# EAGLE schematic TestBoardTarget (EAGLE 7.1.0)
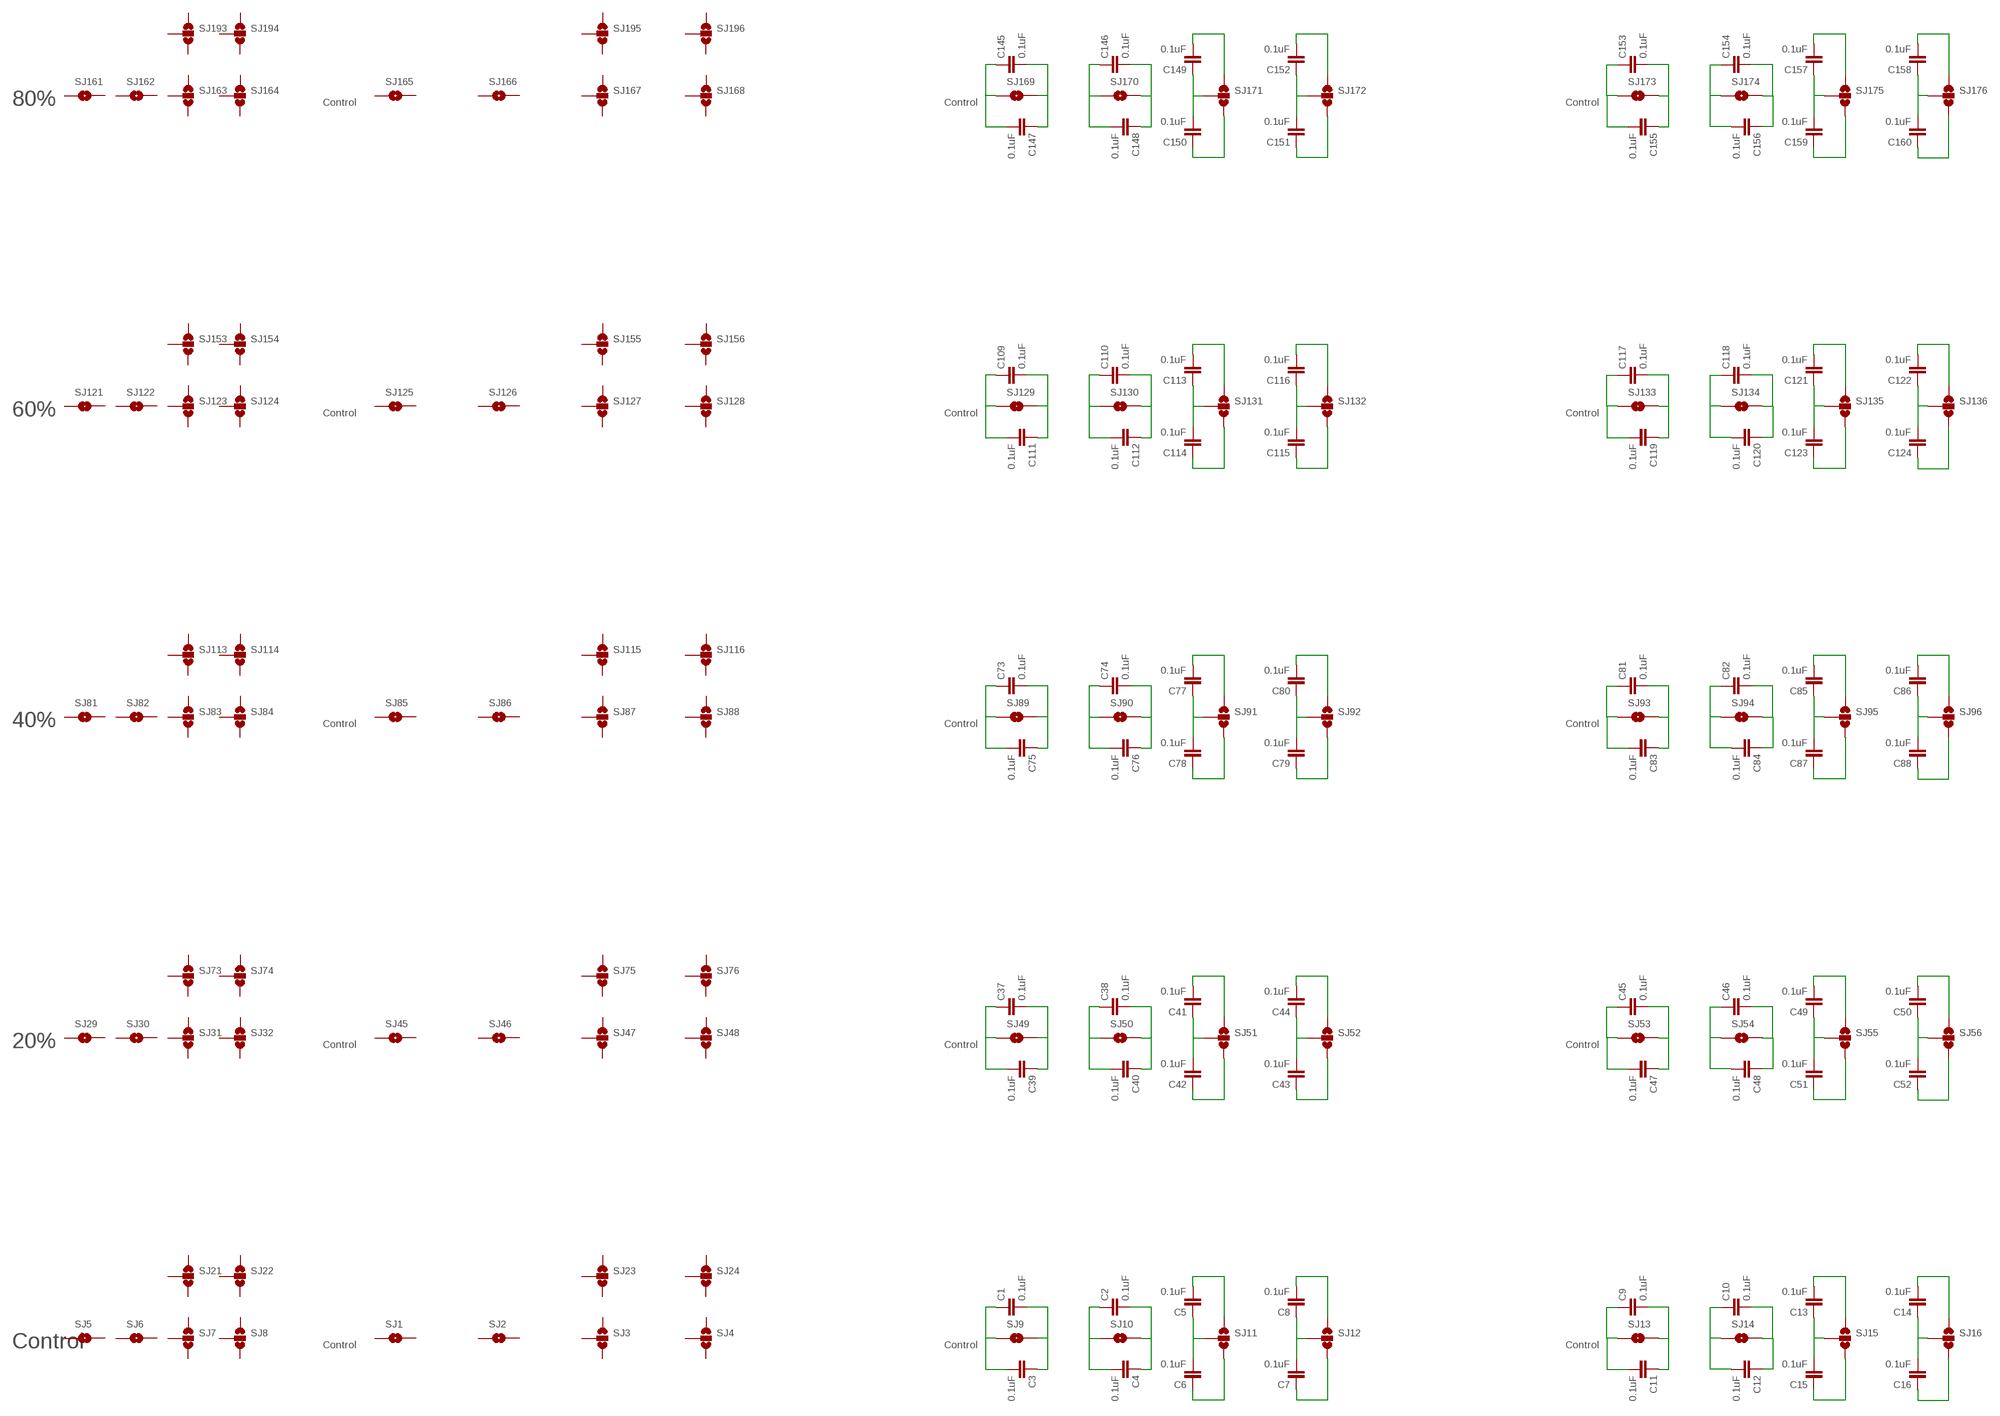
[diagram p0: schematic, sheet 1, part 1 of 3]
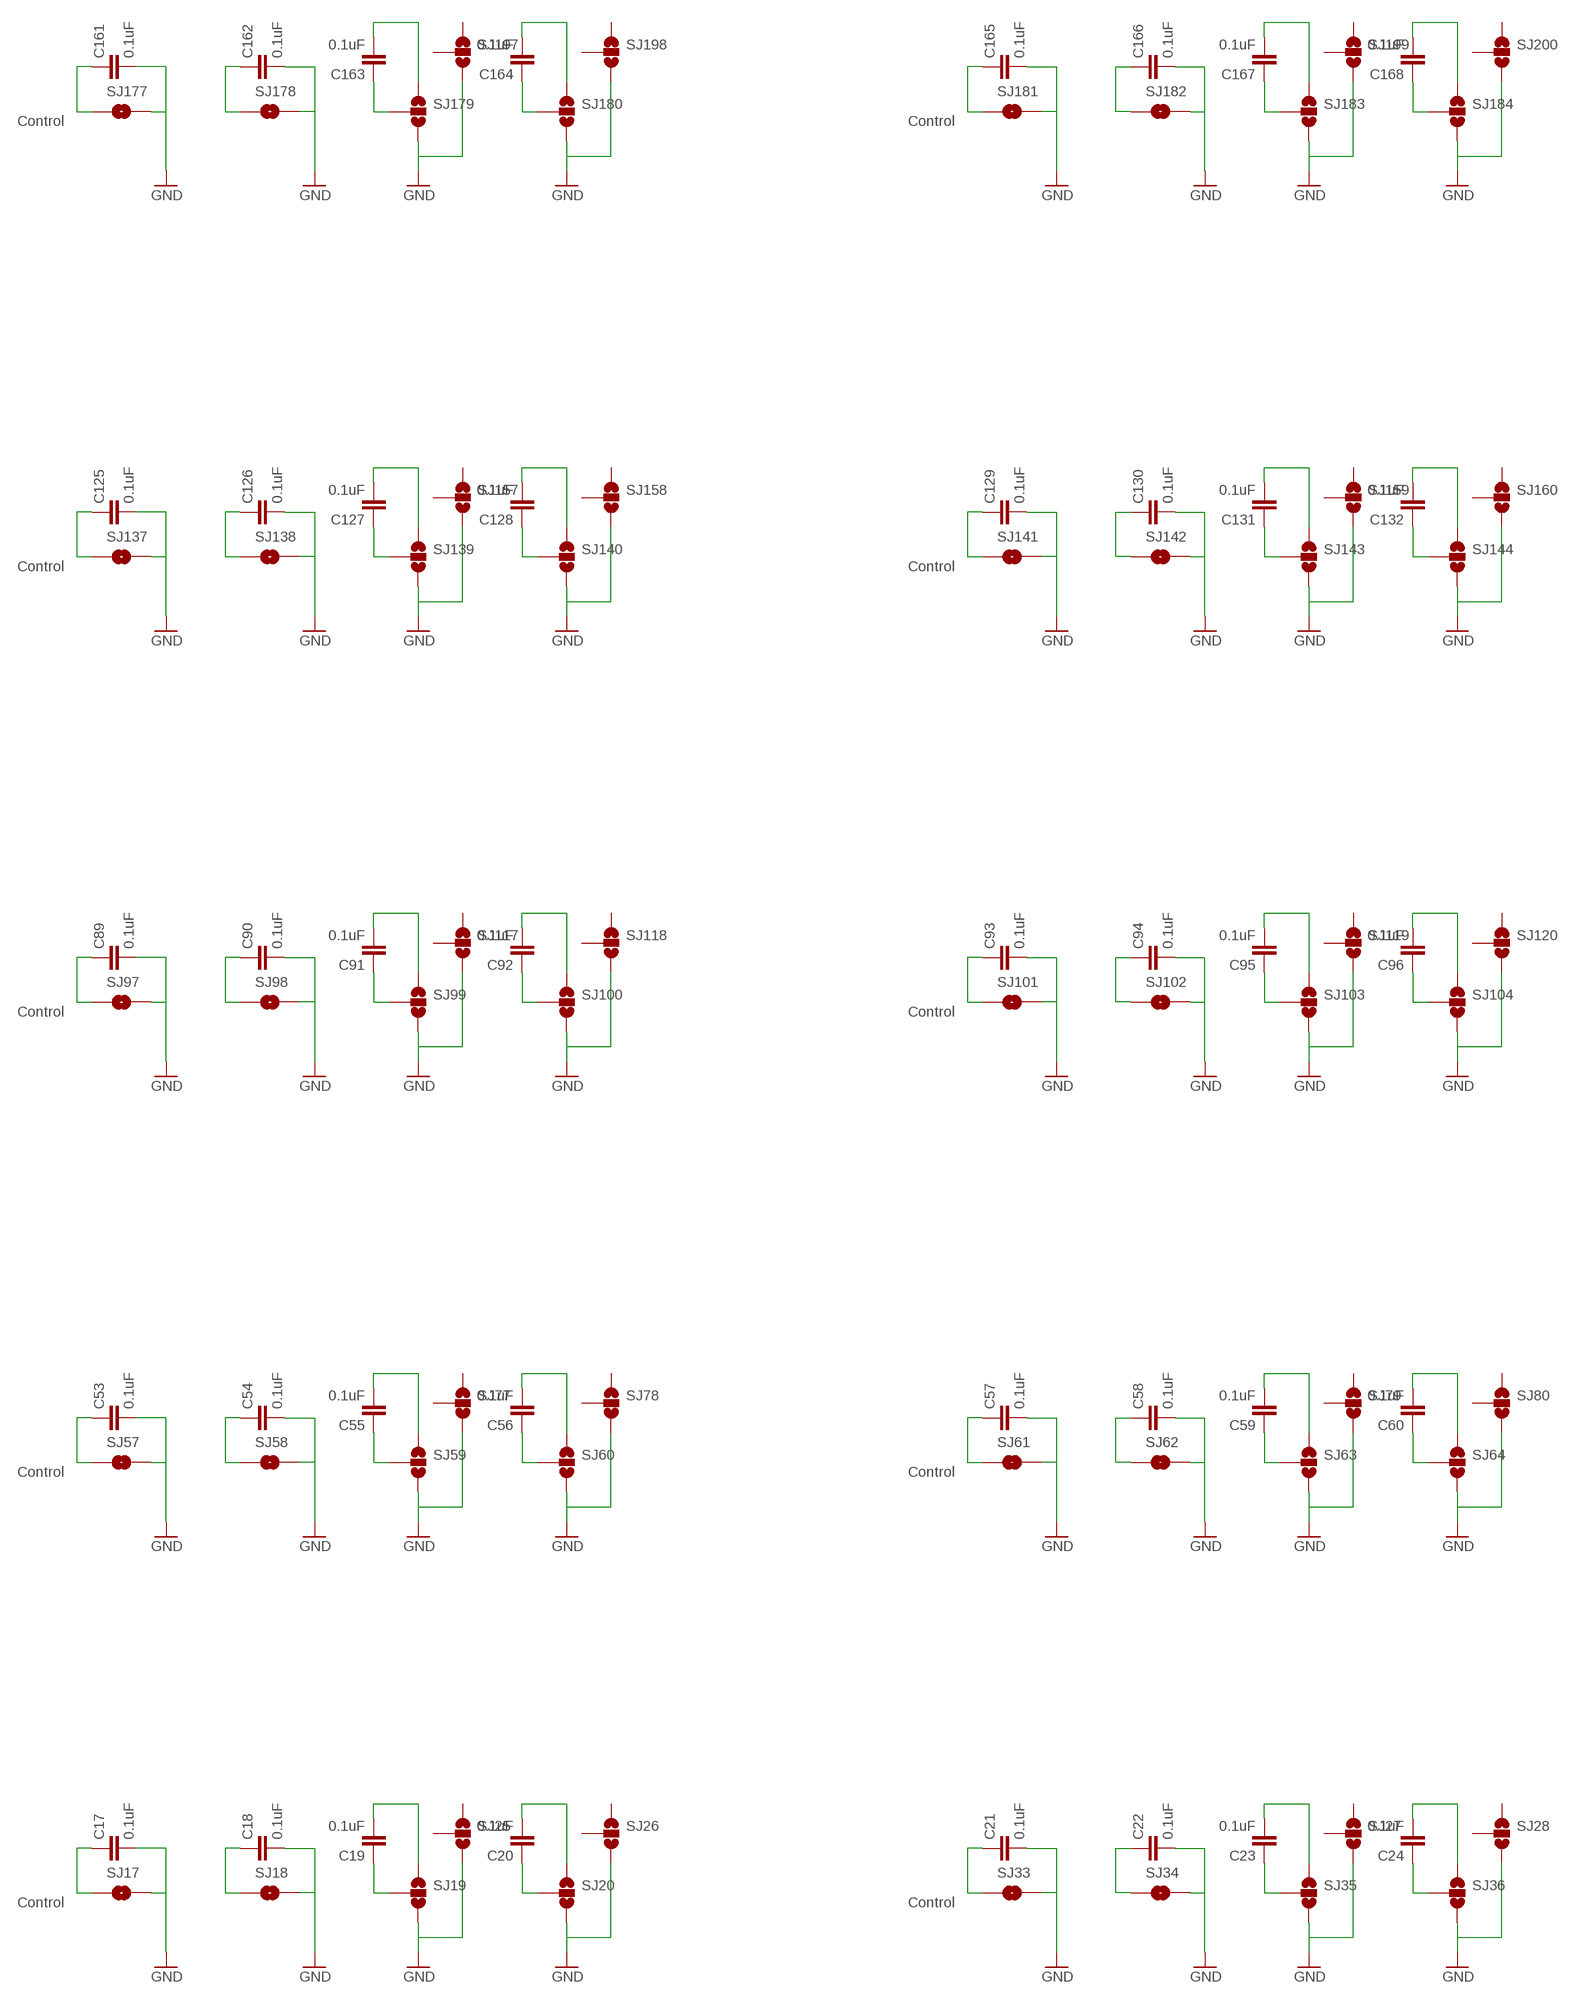
[diagram p1: schematic, sheet 1, part 2 of 3]
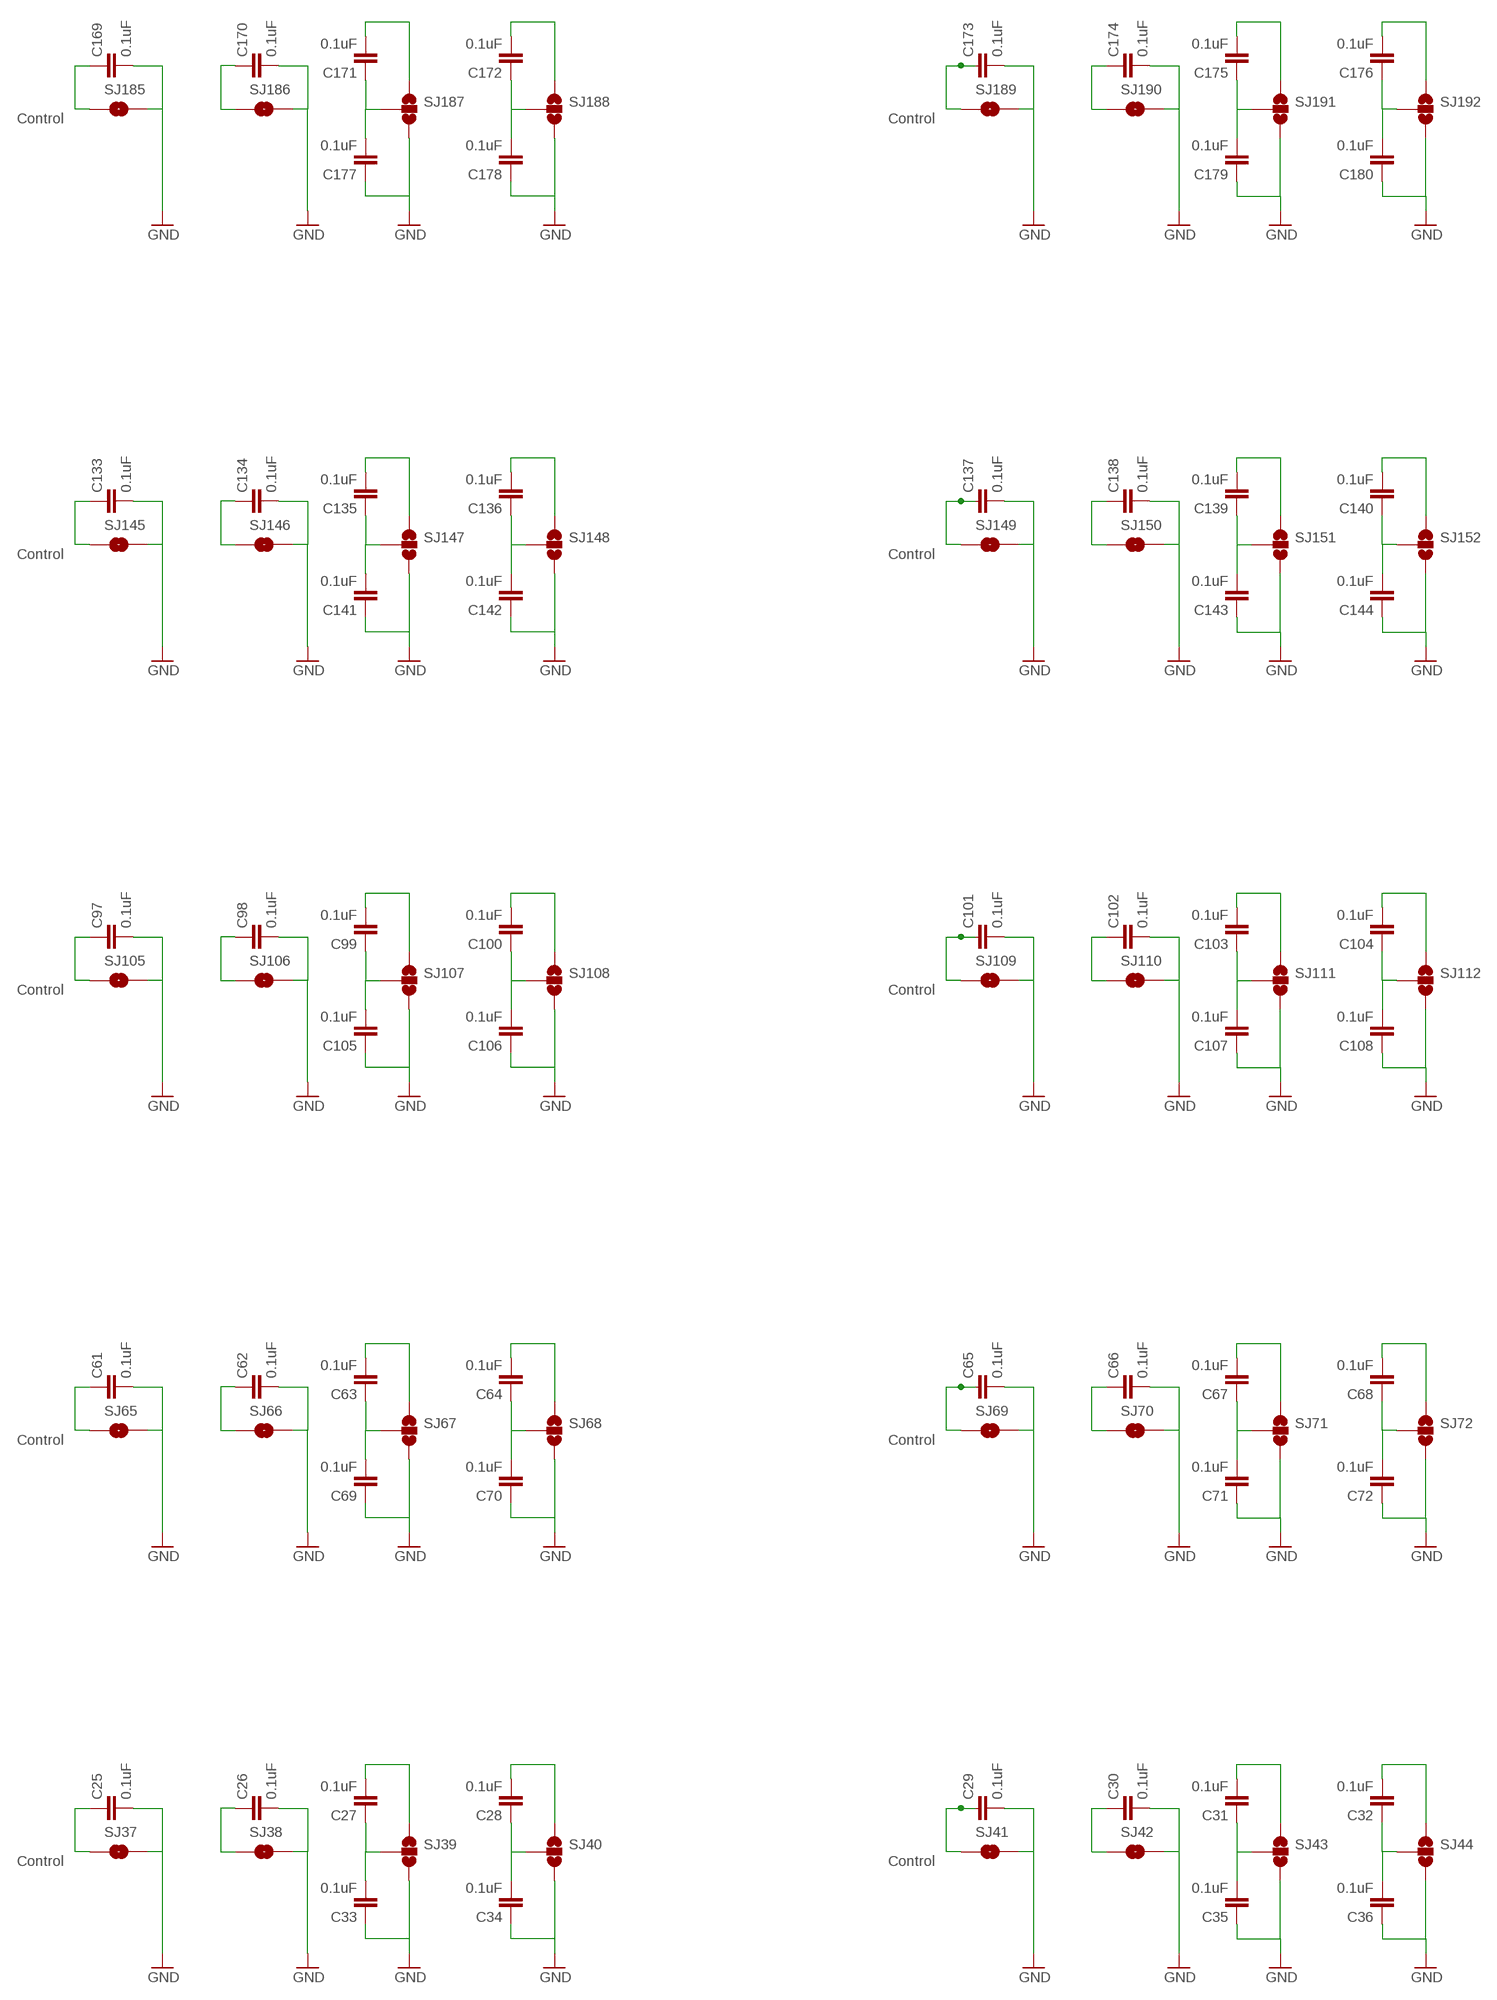
[diagram p2: schematic, sheet 1, part 3 of 3]

## Parts
C1  0.1uF  0.1UF-25V-5%(0603)  [0603-CAP]
C2  0.1uF  0.1UF-25V-5%(0603)  [0603-CAP]
C3  0.1uF  0.1UF-25V-5%(0603)  [0603-CAP]
C4  0.1uF  0.1UF-25V-5%(0603)  [0603-CAP]
C5  0.1uF  0.1UF-25V-5%(0603)  [0603-CAP]
C6  0.1uF  0.1UF-25V-5%(0603)  [0603-CAP]
C7  0.1uF  0.1UF-25V-5%(0603)  [0603-CAP]
C8  0.1uF  0.1UF-25V-5%(0603)  [0603-CAP]
C9  0.1uF  0.1UF-25V-5%(0603)  [0603-CAP]
C10  0.1uF  0.1UF-25V-5%(0603)  [0603-CAP]
C11  0.1uF  0.1UF-25V-5%(0603)  [0603-CAP]
C12  0.1uF  0.1UF-25V-5%(0603)  [0603-CAP]
C13  0.1uF  0.1UF-25V-5%(0603)  [0603-CAP]
C14  0.1uF  0.1UF-25V-5%(0603)  [0603-CAP]
C15  0.1uF  0.1UF-25V-5%(0603)  [0603-CAP]
C16  0.1uF  0.1UF-25V-5%(0603)  [0603-CAP]
C17  0.1uF  0.1UF-25V-5%(0603)  [0603-CAP]
C18  0.1uF  0.1UF-25V-5%(0603)  [0603-CAP]
C19  0.1uF  0.1UF-25V-5%(0603)  [0603-CAP]
C20  0.1uF  0.1UF-25V-5%(0603)  [0603-CAP]
C21  0.1uF  0.1UF-25V-5%(0603)  [0603-CAP]
C22  0.1uF  0.1UF-25V-5%(0603)  [0603-CAP]
C23  0.1uF  0.1UF-25V-5%(0603)  [0603-CAP]
C24  0.1uF  0.1UF-25V-5%(0603)  [0603-CAP]
C25  0.1uF  0.1UF-25V-5%(0603)  [0603-CAP]
C26  0.1uF  0.1UF-25V-5%(0603)  [0603-CAP]
C27  0.1uF  0.1UF-25V-5%(0603)  [0603-CAP]
C28  0.1uF  0.1UF-25V-5%(0603)  [0603-CAP]
C29  0.1uF  0.1UF-25V-5%(0603)  [0603-CAP]
C30  0.1uF  0.1UF-25V-5%(0603)  [0603-CAP]
C31  0.1uF  0.1UF-25V-5%(0603)  [0603-CAP]
C32  0.1uF  0.1UF-25V-5%(0603)  [0603-CAP]
C33  0.1uF  0.1UF-25V-5%(0603)  [0603-CAP]
C34  0.1uF  0.1UF-25V-5%(0603)  [0603-CAP]
C35  0.1uF  0.1UF-25V-5%(0603)  [0603-CAP]
C36  0.1uF  0.1UF-25V-5%(0603)  [0603-CAP]
C37  0.1uF  0.1UF-25V-5%(0603)  [0603-CAP]
C38  0.1uF  0.1UF-25V-5%(0603)  [0603-CAP]
C39  0.1uF  0.1UF-25V-5%(0603)  [0603-CAP]
C40  0.1uF  0.1UF-25V-5%(0603)  [0603-CAP]
C41  0.1uF  0.1UF-25V-5%(0603)  [0603-CAP]
C42  0.1uF  0.1UF-25V-5%(0603)  [0603-CAP]
C43  0.1uF  0.1UF-25V-5%(0603)  [0603-CAP]
C44  0.1uF  0.1UF-25V-5%(0603)  [0603-CAP]
C45  0.1uF  0.1UF-25V-5%(0603)  [0603-CAP]
C46  0.1uF  0.1UF-25V-5%(0603)  [0603-CAP]
C47  0.1uF  0.1UF-25V-5%(0603)  [0603-CAP]
C48  0.1uF  0.1UF-25V-5%(0603)  [0603-CAP]
C49  0.1uF  0.1UF-25V-5%(0603)  [0603-CAP]
C50  0.1uF  0.1UF-25V-5%(0603)  [0603-CAP]
C51  0.1uF  0.1UF-25V-5%(0603)  [0603-CAP]
C52  0.1uF  0.1UF-25V-5%(0603)  [0603-CAP]
C53  0.1uF  0.1UF-25V-5%(0603)  [0603-CAP]
C54  0.1uF  0.1UF-25V-5%(0603)  [0603-CAP]
C55  0.1uF  0.1UF-25V-5%(0603)  [0603-CAP]
C56  0.1uF  0.1UF-25V-5%(0603)  [0603-CAP]
C57  0.1uF  0.1UF-25V-5%(0603)  [0603-CAP]
C58  0.1uF  0.1UF-25V-5%(0603)  [0603-CAP]
C59  0.1uF  0.1UF-25V-5%(0603)  [0603-CAP]
C60  0.1uF  0.1UF-25V-5%(0603)  [0603-CAP]
C61  0.1uF  0.1UF-25V-5%(0603)  [0603-CAP]
C62  0.1uF  0.1UF-25V-5%(0603)  [0603-CAP]
C63  0.1uF  0.1UF-25V-5%(0603)  [0603-CAP]
C64  0.1uF  0.1UF-25V-5%(0603)  [0603-CAP]
C65  0.1uF  0.1UF-25V-5%(0603)  [0603-CAP]
C66  0.1uF  0.1UF-25V-5%(0603)  [0603-CAP]
C67  0.1uF  0.1UF-25V-5%(0603)  [0603-CAP]
C68  0.1uF  0.1UF-25V-5%(0603)  [0603-CAP]
C69  0.1uF  0.1UF-25V-5%(0603)  [0603-CAP]
C70  0.1uF  0.1UF-25V-5%(0603)  [0603-CAP]
C71  0.1uF  0.1UF-25V-5%(0603)  [0603-CAP]
C72  0.1uF  0.1UF-25V-5%(0603)  [0603-CAP]
C73  0.1uF  0.1UF-25V-5%(0603)  [0603-CAP]
C74  0.1uF  0.1UF-25V-5%(0603)  [0603-CAP]
C75  0.1uF  0.1UF-25V-5%(0603)  [0603-CAP]
C76  0.1uF  0.1UF-25V-5%(0603)  [0603-CAP]
C77  0.1uF  0.1UF-25V-5%(0603)  [0603-CAP]
C78  0.1uF  0.1UF-25V-5%(0603)  [0603-CAP]
C79  0.1uF  0.1UF-25V-5%(0603)  [0603-CAP]
C80  0.1uF  0.1UF-25V-5%(0603)  [0603-CAP]
C81  0.1uF  0.1UF-25V-5%(0603)  [0603-CAP]
C82  0.1uF  0.1UF-25V-5%(0603)  [0603-CAP]
C83  0.1uF  0.1UF-25V-5%(0603)  [0603-CAP]
C84  0.1uF  0.1UF-25V-5%(0603)  [0603-CAP]
C85  0.1uF  0.1UF-25V-5%(0603)  [0603-CAP]
C86  0.1uF  0.1UF-25V-5%(0603)  [0603-CAP]
C87  0.1uF  0.1UF-25V-5%(0603)  [0603-CAP]
C88  0.1uF  0.1UF-25V-5%(0603)  [0603-CAP]
C89  0.1uF  0.1UF-25V-5%(0603)  [0603-CAP]
C90  0.1uF  0.1UF-25V-5%(0603)  [0603-CAP]
C91  0.1uF  0.1UF-25V-5%(0603)  [0603-CAP]
C92  0.1uF  0.1UF-25V-5%(0603)  [0603-CAP]
C93  0.1uF  0.1UF-25V-5%(0603)  [0603-CAP]
C94  0.1uF  0.1UF-25V-5%(0603)  [0603-CAP]
C95  0.1uF  0.1UF-25V-5%(0603)  [0603-CAP]
C96  0.1uF  0.1UF-25V-5%(0603)  [0603-CAP]
C97  0.1uF  0.1UF-25V-5%(0603)  [0603-CAP]
C98  0.1uF  0.1UF-25V-5%(0603)  [0603-CAP]
C99  0.1uF  0.1UF-25V-5%(0603)  [0603-CAP]
C100  0.1uF  0.1UF-25V-5%(0603)  [0603-CAP]
C101  0.1uF  0.1UF-25V-5%(0603)  [0603-CAP]
C102  0.1uF  0.1UF-25V-5%(0603)  [0603-CAP]
C103  0.1uF  0.1UF-25V-5%(0603)  [0603-CAP]
C104  0.1uF  0.1UF-25V-5%(0603)  [0603-CAP]
C105  0.1uF  0.1UF-25V-5%(0603)  [0603-CAP]
C106  0.1uF  0.1UF-25V-5%(0603)  [0603-CAP]
C107  0.1uF  0.1UF-25V-5%(0603)  [0603-CAP]
C108  0.1uF  0.1UF-25V-5%(0603)  [0603-CAP]
C109  0.1uF  0.1UF-25V-5%(0603)  [0603-CAP]
C110  0.1uF  0.1UF-25V-5%(0603)  [0603-CAP]
C111  0.1uF  0.1UF-25V-5%(0603)  [0603-CAP]
C112  0.1uF  0.1UF-25V-5%(0603)  [0603-CAP]
C113  0.1uF  0.1UF-25V-5%(0603)  [0603-CAP]
C114  0.1uF  0.1UF-25V-5%(0603)  [0603-CAP]
C115  0.1uF  0.1UF-25V-5%(0603)  [0603-CAP]
C116  0.1uF  0.1UF-25V-5%(0603)  [0603-CAP]
C117  0.1uF  0.1UF-25V-5%(0603)  [0603-CAP]
C118  0.1uF  0.1UF-25V-5%(0603)  [0603-CAP]
C119  0.1uF  0.1UF-25V-5%(0603)  [0603-CAP]
C120  0.1uF  0.1UF-25V-5%(0603)  [0603-CAP]
C121  0.1uF  0.1UF-25V-5%(0603)  [0603-CAP]
C122  0.1uF  0.1UF-25V-5%(0603)  [0603-CAP]
C123  0.1uF  0.1UF-25V-5%(0603)  [0603-CAP]
C124  0.1uF  0.1UF-25V-5%(0603)  [0603-CAP]
C125  0.1uF  0.1UF-25V-5%(0603)  [0603-CAP]
C126  0.1uF  0.1UF-25V-5%(0603)  [0603-CAP]
C127  0.1uF  0.1UF-25V-5%(0603)  [0603-CAP]
C128  0.1uF  0.1UF-25V-5%(0603)  [0603-CAP]
C129  0.1uF  0.1UF-25V-5%(0603)  [0603-CAP]
C130  0.1uF  0.1UF-25V-5%(0603)  [0603-CAP]
C131  0.1uF  0.1UF-25V-5%(0603)  [0603-CAP]
C132  0.1uF  0.1UF-25V-5%(0603)  [0603-CAP]
C133  0.1uF  0.1UF-25V-5%(0603)  [0603-CAP]
C134  0.1uF  0.1UF-25V-5%(0603)  [0603-CAP]
C135  0.1uF  0.1UF-25V-5%(0603)  [0603-CAP]
C136  0.1uF  0.1UF-25V-5%(0603)  [0603-CAP]
C137  0.1uF  0.1UF-25V-5%(0603)  [0603-CAP]
C138  0.1uF  0.1UF-25V-5%(0603)  [0603-CAP]
C139  0.1uF  0.1UF-25V-5%(0603)  [0603-CAP]
C140  0.1uF  0.1UF-25V-5%(0603)  [0603-CAP]
C141  0.1uF  0.1UF-25V-5%(0603)  [0603-CAP]
C142  0.1uF  0.1UF-25V-5%(0603)  [0603-CAP]
C143  0.1uF  0.1UF-25V-5%(0603)  [0603-CAP]
C144  0.1uF  0.1UF-25V-5%(0603)  [0603-CAP]
C145  0.1uF  0.1UF-25V-5%(0603)  [0603-CAP]
C146  0.1uF  0.1UF-25V-5%(0603)  [0603-CAP]
C147  0.1uF  0.1UF-25V-5%(0603)  [0603-CAP]
C148  0.1uF  0.1UF-25V-5%(0603)  [0603-CAP]
C149  0.1uF  0.1UF-25V-5%(0603)  [0603-CAP]
C150  0.1uF  0.1UF-25V-5%(0603)  [0603-CAP]
C151  0.1uF  0.1UF-25V-5%(0603)  [0603-CAP]
C152  0.1uF  0.1UF-25V-5%(0603)  [0603-CAP]
C153  0.1uF  0.1UF-25V-5%(0603)  [0603-CAP]
C154  0.1uF  0.1UF-25V-5%(0603)  [0603-CAP]
C155  0.1uF  0.1UF-25V-5%(0603)  [0603-CAP]
C156  0.1uF  0.1UF-25V-5%(0603)  [0603-CAP]
C157  0.1uF  0.1UF-25V-5%(0603)  [0603-CAP]
C158  0.1uF  0.1UF-25V-5%(0603)  [0603-CAP]
C159  0.1uF  0.1UF-25V-5%(0603)  [0603-CAP]
C160  0.1uF  0.1UF-25V-5%(0603)  [0603-CAP]
C161  0.1uF  0.1UF-25V-5%(0603)  [0603-CAP]
C162  0.1uF  0.1UF-25V-5%(0603)  [0603-CAP]
C163  0.1uF  0.1UF-25V-5%(0603)  [0603-CAP]
C164  0.1uF  0.1UF-25V-5%(0603)  [0603-CAP]
C165  0.1uF  0.1UF-25V-5%(0603)  [0603-CAP]
C166  0.1uF  0.1UF-25V-5%(0603)  [0603-CAP]
C167  0.1uF  0.1UF-25V-5%(0603)  [0603-CAP]
C168  0.1uF  0.1UF-25V-5%(0603)  [0603-CAP]
C169  0.1uF  0.1UF-25V-5%(0603)  [0603-CAP]
C170  0.1uF  0.1UF-25V-5%(0603)  [0603-CAP]
C171  0.1uF  0.1UF-25V-5%(0603)  [0603-CAP]
C172  0.1uF  0.1UF-25V-5%(0603)  [0603-CAP]
C173  0.1uF  0.1UF-25V-5%(0603)  [0603-CAP]
C174  0.1uF  0.1UF-25V-5%(0603)  [0603-CAP]
C175  0.1uF  0.1UF-25V-5%(0603)  [0603-CAP]
C176  0.1uF  0.1UF-25V-5%(0603)  [0603-CAP]
C177  0.1uF  0.1UF-25V-5%(0603)  [0603-CAP]
C178  0.1uF  0.1UF-25V-5%(0603)  [0603-CAP]
C179  0.1uF  0.1UF-25V-5%(0603)  [0603-CAP]
C180  0.1uF  0.1UF-25V-5%(0603)  [0603-CAP]
SJ1  JUMPER-PAD-2-NO  [PAD-JUMPER-2-NO_NO_SILK]
SJ2  JUMPER-PAD-2-NO  [PAD-JUMPER-2-NO_NO_SILK]
SJ3  JUMPER-PAD-3-NOYES_SILK  [PAD-JUMPER-3-NO_YES_SILK]
SJ4  JUMPER-PAD-3-NOYES_SILK  [PAD-JUMPER-3-NO_YES_SILK]
SJ5  JUMPER-PAD-2-NO  [PAD-JUMPER-2-NO_NO_SILK]
SJ6  JUMPER-PAD-2-NO  [PAD-JUMPER-2-NO_NO_SILK]
SJ7  JUMPER-PAD-3-NOYES_SILK  [PAD-JUMPER-3-NO_YES_SILK]
SJ8  JUMPER-PAD-3-NOYES_SILK  [PAD-JUMPER-3-NO_YES_SILK]
SJ9  JUMPER-PAD-2-NO  [PAD-JUMPER-2-NO_NO_SILK]
SJ10  JUMPER-PAD-2-NO  [PAD-JUMPER-2-NO_NO_SILK]
SJ11  JUMPER-PAD-3-NOYES_SILK  [PAD-JUMPER-3-NO_YES_SILK]
SJ12  JUMPER-PAD-3-NOYES_SILK  [PAD-JUMPER-3-NO_YES_SILK]
SJ13  JUMPER-PAD-2-NO  [PAD-JUMPER-2-NO_NO_SILK]
SJ14  JUMPER-PAD-2-NO  [PAD-JUMPER-2-NO_NO_SILK]
SJ15  JUMPER-PAD-3-NOYES_SILK  [PAD-JUMPER-3-NO_YES_SILK]
SJ16  JUMPER-PAD-3-NOYES_SILK  [PAD-JUMPER-3-NO_YES_SILK]
SJ17  JUMPER-PAD-2-NO  [PAD-JUMPER-2-NO_NO_SILK]
SJ18  JUMPER-PAD-2-NO  [PAD-JUMPER-2-NO_NO_SILK]
SJ19  JUMPER-PAD-3-NOYES_SILK  [PAD-JUMPER-3-NO_YES_SILK]
SJ20  JUMPER-PAD-3-NOYES_SILK  [PAD-JUMPER-3-NO_YES_SILK]
SJ21  JUMPER-PAD-3-NOYES_SILK  [PAD-JUMPER-3-NO_YES_SILK]
SJ22  JUMPER-PAD-3-NOYES_SILK  [PAD-JUMPER-3-NO_YES_SILK]
SJ23  JUMPER-PAD-3-NOYES_SILK  [PAD-JUMPER-3-NO_YES_SILK]
SJ24  JUMPER-PAD-3-NOYES_SILK  [PAD-JUMPER-3-NO_YES_SILK]
SJ25  JUMPER-PAD-3-NO3_0  [PAD-JUMPER-3-NO_YES_SILK_ALL]
SJ26  JUMPER-PAD-3-NO3_0  [PAD-JUMPER-3-NO_YES_SILK_ALL]
SJ27  JUMPER-PAD-3-NO3_0  [PAD-JUMPER-3-NO_YES_SILK_ALL]
SJ28  JUMPER-PAD-3-NO3_0  [PAD-JUMPER-3-NO_YES_SILK_ALL]
SJ29  JUMPER-PAD-2-NO20  [PAD-JUMPER-2-NO_NO_SILK_20]
SJ30  JUMPER-PAD-2-NO20  [PAD-JUMPER-2-NO_NO_SILK_20]
SJ31  JUMPER-PAD-3-NO2_20  [PAD-JUMPER-3-NO_YES_SILK_20]
SJ32  JUMPER-PAD-3-NO2_20  [PAD-JUMPER-3-NO_YES_SILK_20]
SJ33  JUMPER-PAD-2-NO  [PAD-JUMPER-2-NO_NO_SILK]
SJ34  JUMPER-PAD-2-NO  [PAD-JUMPER-2-NO_NO_SILK]
SJ35  JUMPER-PAD-3-NOYES_SILK  [PAD-JUMPER-3-NO_YES_SILK]
SJ36  JUMPER-PAD-3-NOYES_SILK  [PAD-JUMPER-3-NO_YES_SILK]
SJ37  JUMPER-PAD-2-NO  [PAD-JUMPER-2-NO_NO_SILK]
SJ38  JUMPER-PAD-2-NO  [PAD-JUMPER-2-NO_NO_SILK]
SJ39  JUMPER-PAD-3-NOYES_SILK  [PAD-JUMPER-3-NO_YES_SILK]
SJ40  JUMPER-PAD-3-NOYES_SILK  [PAD-JUMPER-3-NO_YES_SILK]
SJ41  JUMPER-PAD-2-NO  [PAD-JUMPER-2-NO_NO_SILK]
SJ42  JUMPER-PAD-2-NO  [PAD-JUMPER-2-NO_NO_SILK]
SJ43  JUMPER-PAD-3-NOYES_SILK  [PAD-JUMPER-3-NO_YES_SILK]
SJ44  JUMPER-PAD-3-NOYES_SILK  [PAD-JUMPER-3-NO_YES_SILK]
SJ45  JUMPER-PAD-2-NO20  [PAD-JUMPER-2-NO_NO_SILK_20]
SJ46  JUMPER-PAD-2-NO20  [PAD-JUMPER-2-NO_NO_SILK_20]
SJ47  JUMPER-PAD-3-NO2_20  [PAD-JUMPER-3-NO_YES_SILK_20]
SJ48  JUMPER-PAD-3-NO2_20  [PAD-JUMPER-3-NO_YES_SILK_20]
SJ49  JUMPER-PAD-2-NO20  [PAD-JUMPER-2-NO_NO_SILK_20]
SJ50  JUMPER-PAD-2-NO20  [PAD-JUMPER-2-NO_NO_SILK_20]
SJ51  JUMPER-PAD-3-NO2_20  [PAD-JUMPER-3-NO_YES_SILK_20]
SJ52  JUMPER-PAD-3-NO2_20  [PAD-JUMPER-3-NO_YES_SILK_20]
SJ53  JUMPER-PAD-2-NO20  [PAD-JUMPER-2-NO_NO_SILK_20]
SJ54  JUMPER-PAD-2-NO20  [PAD-JUMPER-2-NO_NO_SILK_20]
SJ55  JUMPER-PAD-3-NO2_20  [PAD-JUMPER-3-NO_YES_SILK_20]
SJ56  JUMPER-PAD-3-NO2_20  [PAD-JUMPER-3-NO_YES_SILK_20]
SJ57  JUMPER-PAD-2-NO20  [PAD-JUMPER-2-NO_NO_SILK_20]
SJ58  JUMPER-PAD-2-NO20  [PAD-JUMPER-2-NO_NO_SILK_20]
SJ59  JUMPER-PAD-3-NO2_20  [PAD-JUMPER-3-NO_YES_SILK_20]
SJ60  JUMPER-PAD-3-NO2_20  [PAD-JUMPER-3-NO_YES_SILK_20]
SJ61  JUMPER-PAD-2-NO20  [PAD-JUMPER-2-NO_NO_SILK_20]
SJ62  JUMPER-PAD-2-NO20  [PAD-JUMPER-2-NO_NO_SILK_20]
SJ63  JUMPER-PAD-3-NO2_20  [PAD-JUMPER-3-NO_YES_SILK_20]
SJ64  JUMPER-PAD-3-NO2_20  [PAD-JUMPER-3-NO_YES_SILK_20]
SJ65  JUMPER-PAD-2-NO20  [PAD-JUMPER-2-NO_NO_SILK_20]
SJ66  JUMPER-PAD-2-NO20  [PAD-JUMPER-2-NO_NO_SILK_20]
SJ67  JUMPER-PAD-3-NO2_20  [PAD-JUMPER-3-NO_YES_SILK_20]
SJ68  JUMPER-PAD-3-NO2_20  [PAD-JUMPER-3-NO_YES_SILK_20]
SJ69  JUMPER-PAD-2-NO  [PAD-JUMPER-2-NO_NO_SILK]
SJ70  JUMPER-PAD-2-NO  [PAD-JUMPER-2-NO_NO_SILK]
SJ71  JUMPER-PAD-3-NO2_20  [PAD-JUMPER-3-NO_YES_SILK_20]
SJ72  JUMPER-PAD-3-NO2_20  [PAD-JUMPER-3-NO_YES_SILK_20]
SJ73  JUMPER-PAD-3-NOYES_SILK  [PAD-JUMPER-3-NO_YES_SILK]
SJ74  JUMPER-PAD-3-NOYES_SILK  [PAD-JUMPER-3-NO_YES_SILK]
SJ75  JUMPER-PAD-3-NOYES_SILK  [PAD-JUMPER-3-NO_YES_SILK]
SJ76  JUMPER-PAD-3-NOYES_SILK  [PAD-JUMPER-3-NO_YES_SILK]
SJ77  JUMPER-PAD-3-NO3_20  [PAD-JUMPER-3-NO_YES_SILK_ALL_20]
SJ78  JUMPER-PAD-3-NO3_20  [PAD-JUMPER-3-NO_YES_SILK_ALL_20]
SJ79  JUMPER-PAD-3-NO3_20  [PAD-JUMPER-3-NO_YES_SILK_ALL_20]
SJ80  JUMPER-PAD-3-NO3_20  [PAD-JUMPER-3-NO_YES_SILK_ALL_20]
SJ81  JUMPER-PAD-2-NO40  [PAD-JUMPER-2-NO_NO_SILK_40]
SJ82  JUMPER-PAD-2-NO40  [PAD-JUMPER-2-NO_NO_SILK_40]
SJ83  JUMPER-PAD-3-NO2_40  [PAD-JUMPER-3-NO_YES_SILK_40]
SJ84  JUMPER-PAD-3-NO2_40  [PAD-JUMPER-3-NO_YES_SILK_40]
SJ85  JUMPER-PAD-2-NO40  [PAD-JUMPER-2-NO_NO_SILK_40]
SJ86  JUMPER-PAD-2-NO40  [PAD-JUMPER-2-NO_NO_SILK_40]
SJ87  JUMPER-PAD-3-NO2_40  [PAD-JUMPER-3-NO_YES_SILK_40]
SJ88  JUMPER-PAD-3-NO2_40  [PAD-JUMPER-3-NO_YES_SILK_40]
SJ89  JUMPER-PAD-2-NO40  [PAD-JUMPER-2-NO_NO_SILK_40]
SJ90  JUMPER-PAD-2-NO40  [PAD-JUMPER-2-NO_NO_SILK_40]
SJ91  JUMPER-PAD-3-NO2_40  [PAD-JUMPER-3-NO_YES_SILK_40]
SJ92  JUMPER-PAD-3-NO2_40  [PAD-JUMPER-3-NO_YES_SILK_40]
SJ93  JUMPER-PAD-2-NO40  [PAD-JUMPER-2-NO_NO_SILK_40]
SJ94  JUMPER-PAD-2-NO40  [PAD-JUMPER-2-NO_NO_SILK_40]
SJ95  JUMPER-PAD-3-NO2_40  [PAD-JUMPER-3-NO_YES_SILK_40]
SJ96  JUMPER-PAD-3-NO2_40  [PAD-JUMPER-3-NO_YES_SILK_40]
SJ97  JUMPER-PAD-2-NO40  [PAD-JUMPER-2-NO_NO_SILK_40]
SJ98  JUMPER-PAD-2-NO40  [PAD-JUMPER-2-NO_NO_SILK_40]
SJ99  JUMPER-PAD-3-NO2_40  [PAD-JUMPER-3-NO_YES_SILK_40]
SJ100  JUMPER-PAD-3-NO2_40  [PAD-JUMPER-3-NO_YES_SILK_40]
SJ101  JUMPER-PAD-2-NO40  [PAD-JUMPER-2-NO_NO_SILK_40]
SJ102  JUMPER-PAD-2-NO40  [PAD-JUMPER-2-NO_NO_SILK_40]
SJ103  JUMPER-PAD-3-NO2_40  [PAD-JUMPER-3-NO_YES_SILK_40]
SJ104  JUMPER-PAD-3-NO2_40  [PAD-JUMPER-3-NO_YES_SILK_40]
SJ105  JUMPER-PAD-2-NO40  [PAD-JUMPER-2-NO_NO_SILK_40]
SJ106  JUMPER-PAD-2-NO40  [PAD-JUMPER-2-NO_NO_SILK_40]
SJ107  JUMPER-PAD-3-NO2_40  [PAD-JUMPER-3-NO_YES_SILK_40]
SJ108  JUMPER-PAD-3-NO2_40  [PAD-JUMPER-3-NO_YES_SILK_40]
SJ109  JUMPER-PAD-2-NO40  [PAD-JUMPER-2-NO_NO_SILK_40]
SJ110  JUMPER-PAD-2-NO40  [PAD-JUMPER-2-NO_NO_SILK_40]
SJ111  JUMPER-PAD-3-NO2_40  [PAD-JUMPER-3-NO_YES_SILK_40]
SJ112  JUMPER-PAD-3-NO2_40  [PAD-JUMPER-3-NO_YES_SILK_40]
SJ113  JUMPER-PAD-3-NO3_40  [PAD-JUMPER-3-NO_YES_SILK_ALL_40]
SJ114  JUMPER-PAD-3-NO3_40  [PAD-JUMPER-3-NO_YES_SILK_ALL_40]
SJ115  JUMPER-PAD-3-NO3_40  [PAD-JUMPER-3-NO_YES_SILK_ALL_40]
SJ116  JUMPER-PAD-3-NO3_40  [PAD-JUMPER-3-NO_YES_SILK_ALL_40]
SJ117  JUMPER-PAD-3-NO3_40  [PAD-JUMPER-3-NO_YES_SILK_ALL_40]
SJ118  JUMPER-PAD-3-NO3_40  [PAD-JUMPER-3-NO_YES_SILK_ALL_40]
SJ119  JUMPER-PAD-3-NO3_40  [PAD-JUMPER-3-NO_YES_SILK_ALL_40]
SJ120  JUMPER-PAD-3-NO3_40  [PAD-JUMPER-3-NO_YES_SILK_ALL_40]
SJ121  JUMPER-PAD-2-NO60  [PAD-JUMPER-2-NO_NO_SILK_60]
SJ122  JUMPER-PAD-2-NO60  [PAD-JUMPER-2-NO_NO_SILK_60]
SJ123  JUMPER-PAD-3-NO2_60  [PAD-JUMPER-3-NO_YES_SILK_60]
SJ124  JUMPER-PAD-3-NO2_60  [PAD-JUMPER-3-NO_YES_SILK_60]
SJ125  JUMPER-PAD-2-NO60  [PAD-JUMPER-2-NO_NO_SILK_60]
SJ126  JUMPER-PAD-2-NO60  [PAD-JUMPER-2-NO_NO_SILK_60]
SJ127  JUMPER-PAD-3-NO2_60  [PAD-JUMPER-3-NO_YES_SILK_60]
SJ128  JUMPER-PAD-3-NO2_60  [PAD-JUMPER-3-NO_YES_SILK_60]
SJ129  JUMPER-PAD-2-NO60  [PAD-JUMPER-2-NO_NO_SILK_60]
SJ130  JUMPER-PAD-2-NO60  [PAD-JUMPER-2-NO_NO_SILK_60]
SJ131  JUMPER-PAD-3-NO2_60  [PAD-JUMPER-3-NO_YES_SILK_60]
SJ132  JUMPER-PAD-3-NO2_60  [PAD-JUMPER-3-NO_YES_SILK_60]
SJ133  JUMPER-PAD-2-NO60  [PAD-JUMPER-2-NO_NO_SILK_60]
SJ134  JUMPER-PAD-2-NO60  [PAD-JUMPER-2-NO_NO_SILK_60]
SJ135  JUMPER-PAD-3-NO2_60  [PAD-JUMPER-3-NO_YES_SILK_60]
SJ136  JUMPER-PAD-3-NO2_60  [PAD-JUMPER-3-NO_YES_SILK_60]
SJ137  JUMPER-PAD-2-NO60  [PAD-JUMPER-2-NO_NO_SILK_60]
SJ138  JUMPER-PAD-2-NO60  [PAD-JUMPER-2-NO_NO_SILK_60]
SJ139  JUMPER-PAD-3-NO2_60  [PAD-JUMPER-3-NO_YES_SILK_60]
SJ140  JUMPER-PAD-3-NO2_60  [PAD-JUMPER-3-NO_YES_SILK_60]
SJ141  JUMPER-PAD-2-NO60  [PAD-JUMPER-2-NO_NO_SILK_60]
SJ142  JUMPER-PAD-2-NO60  [PAD-JUMPER-2-NO_NO_SILK_60]
SJ143  JUMPER-PAD-3-NO2_60  [PAD-JUMPER-3-NO_YES_SILK_60]
SJ144  JUMPER-PAD-3-NO2_60  [PAD-JUMPER-3-NO_YES_SILK_60]
SJ145  JUMPER-PAD-2-NO60  [PAD-JUMPER-2-NO_NO_SILK_60]
SJ146  JUMPER-PAD-2-NO60  [PAD-JUMPER-2-NO_NO_SILK_60]
SJ147  JUMPER-PAD-3-NO2_60  [PAD-JUMPER-3-NO_YES_SILK_60]
SJ148  JUMPER-PAD-3-NO2_60  [PAD-JUMPER-3-NO_YES_SILK_60]
SJ149  JUMPER-PAD-2-NO60  [PAD-JUMPER-2-NO_NO_SILK_60]
SJ150  JUMPER-PAD-2-NO60  [PAD-JUMPER-2-NO_NO_SILK_60]
SJ151  JUMPER-PAD-3-NO2_60  [PAD-JUMPER-3-NO_YES_SILK_60]
SJ152  JUMPER-PAD-3-NO2_60  [PAD-JUMPER-3-NO_YES_SILK_60]
SJ153  JUMPER-PAD-3-NO3_60  [PAD-JUMPER-3-NO_YES_SILK_ALL_60]
SJ154  JUMPER-PAD-3-NO3_60  [PAD-JUMPER-3-NO_YES_SILK_ALL_60]
SJ155  JUMPER-PAD-3-NO3_60  [PAD-JUMPER-3-NO_YES_SILK_ALL_60]
SJ156  JUMPER-PAD-3-NO3_60  [PAD-JUMPER-3-NO_YES_SILK_ALL_60]
SJ157  JUMPER-PAD-3-NO3_60  [PAD-JUMPER-3-NO_YES_SILK_ALL_60]
SJ158  JUMPER-PAD-3-NO3_60  [PAD-JUMPER-3-NO_YES_SILK_ALL_60]
SJ159  JUMPER-PAD-3-NO3_60  [PAD-JUMPER-3-NO_YES_SILK_ALL_60]
SJ160  JUMPER-PAD-3-NO3_60  [PAD-JUMPER-3-NO_YES_SILK_ALL_60]
SJ161  JUMPER-PAD-2-NO80  [PAD-JUMPER-2-NO_NO_SILK_80]
SJ162  JUMPER-PAD-2-NO80  [PAD-JUMPER-2-NO_NO_SILK_80]
SJ163  JUMPER-PAD-3-NO2_80  [PAD-JUMPER-3-NO_YES_SILK_80]
SJ164  JUMPER-PAD-3-NO2_80  [PAD-JUMPER-3-NO_YES_SILK_80]
SJ165  JUMPER-PAD-2-NO80  [PAD-JUMPER-2-NO_NO_SILK_80]
SJ166  JUMPER-PAD-2-NO80  [PAD-JUMPER-2-NO_NO_SILK_80]
SJ167  JUMPER-PAD-3-NO2_80  [PAD-JUMPER-3-NO_YES_SILK_80]
SJ168  JUMPER-PAD-3-NO2_80  [PAD-JUMPER-3-NO_YES_SILK_80]
SJ169  JUMPER-PAD-2-NO80  [PAD-JUMPER-2-NO_NO_SILK_80]
SJ170  JUMPER-PAD-2-NO80  [PAD-JUMPER-2-NO_NO_SILK_80]
SJ171  JUMPER-PAD-3-NO2_80  [PAD-JUMPER-3-NO_YES_SILK_80]
SJ172  JUMPER-PAD-3-NO2_80  [PAD-JUMPER-3-NO_YES_SILK_80]
SJ173  JUMPER-PAD-2-NO80  [PAD-JUMPER-2-NO_NO_SILK_80]
SJ174  JUMPER-PAD-2-NO80  [PAD-JUMPER-2-NO_NO_SILK_80]
SJ175  JUMPER-PAD-3-NO2_80  [PAD-JUMPER-3-NO_YES_SILK_80]
SJ176  JUMPER-PAD-3-NO2_80  [PAD-JUMPER-3-NO_YES_SILK_80]
SJ177  JUMPER-PAD-2-NO80  [PAD-JUMPER-2-NO_NO_SILK_80]
SJ178  JUMPER-PAD-2-NO80  [PAD-JUMPER-2-NO_NO_SILK_80]
SJ179  JUMPER-PAD-3-NO2_80  [PAD-JUMPER-3-NO_YES_SILK_80]
SJ180  JUMPER-PAD-3-NO2_80  [PAD-JUMPER-3-NO_YES_SILK_80]
SJ181  JUMPER-PAD-2-NO80  [PAD-JUMPER-2-NO_NO_SILK_80]
SJ182  JUMPER-PAD-2-NO80  [PAD-JUMPER-2-NO_NO_SILK_80]
SJ183  JUMPER-PAD-3-NO2_80  [PAD-JUMPER-3-NO_YES_SILK_80]
SJ184  JUMPER-PAD-3-NO2_80  [PAD-JUMPER-3-NO_YES_SILK_80]
SJ185  JUMPER-PAD-2-NO80  [PAD-JUMPER-2-NO_NO_SILK_80]
SJ186  JUMPER-PAD-2-NO80  [PAD-JUMPER-2-NO_NO_SILK_80]
SJ187  JUMPER-PAD-3-NO2_80  [PAD-JUMPER-3-NO_YES_SILK_80]
SJ188  JUMPER-PAD-3-NO2_80  [PAD-JUMPER-3-NO_YES_SILK_80]
SJ189  JUMPER-PAD-2-NO80  [PAD-JUMPER-2-NO_NO_SILK_80]
SJ190  JUMPER-PAD-2-NO80  [PAD-JUMPER-2-NO_NO_SILK_80]
SJ191  JUMPER-PAD-3-NO2_80  [PAD-JUMPER-3-NO_YES_SILK_80]
SJ192  JUMPER-PAD-3-NO2_80  [PAD-JUMPER-3-NO_YES_SILK_80]
SJ193  JUMPER-PAD-3-NO3_80  [PAD-JUMPER-3-NO_YES_SILK_ALL_80]
SJ194  JUMPER-PAD-3-NO3_80  [PAD-JUMPER-3-NO_YES_SILK_ALL_80]
SJ195  JUMPER-PAD-3-NO3_80  [PAD-JUMPER-3-NO_YES_SILK_ALL_80]
SJ196  JUMPER-PAD-3-NO3_80  [PAD-JUMPER-3-NO_YES_SILK_ALL_80]
SJ197  JUMPER-PAD-3-NO3_80  [PAD-JUMPER-3-NO_YES_SILK_ALL_80]
SJ198  JUMPER-PAD-3-NO3_80  [PAD-JUMPER-3-NO_YES_SILK_ALL_80]
SJ199  JUMPER-PAD-3-NO3_80  [PAD-JUMPER-3-NO_YES_SILK_ALL_80]
SJ200  JUMPER-PAD-3-NO3_80  [PAD-JUMPER-3-NO_YES_SILK_ALL_80]

## Nets
GND: C17.2 C18.2 C21.2 C22.2 C25.2 C26.2 C29.2 C30.2 C33.1 C34.1 C35.1 C36.1 C53.2 C54.2 C57.2 C58.2 C61.2 C62.2 C65.2 C66.2 C69.1 C70.1 C71.1 C72.1 C89.2 C90.2 C93.2 C94.2 C97.2 C98.2 C101.2 C102.2 C105.1 C106.1 C107.1 C108.1 C125.2 C126.2 C129.2 C130.2 C133.2 C134.2 C137.2 C138.2 C141.1 C142.1 C143.1 C144.1 C161.2 C162.2 C165.2 C166.2 C169.2 C170.2 C173.2 C174.2 C177.1 C178.1 C179.1 C180.1 SJ17.2 SJ18.2 SJ19.3 SJ20.3 SJ25.3 SJ26.3 SJ27.3 SJ28.3 SJ33.2 SJ34.2 SJ35.3 SJ36.3 SJ37.2 SJ38.2 SJ39.3 SJ40.3 SJ41.2 SJ42.2 SJ43.3 SJ44.3 SJ57.2 SJ58.2 SJ59.3 SJ60.3 SJ61.2 SJ62.2 SJ63.3 SJ64.3 SJ65.2 SJ66.2 SJ67.3 SJ68.3 SJ69.2 SJ70.2 SJ71.3 SJ72.3 SJ77.3 SJ78.3 SJ79.3 SJ80.3 SJ97.2 SJ98.2 SJ99.3 SJ100.3 SJ101.2 SJ102.2 SJ103.3 SJ104.3 SJ105.2 SJ106.2 SJ107.3 SJ108.3 SJ109.2 SJ110.2 SJ111.3 SJ112.3 SJ117.3 SJ118.3 SJ119.3 SJ120.3 SJ137.2 SJ138.2 SJ139.3 SJ140.3 SJ141.2 SJ142.2 SJ143.3 SJ144.3 SJ145.2 SJ146.2 SJ147.3 SJ148.3 SJ149.2 SJ150.2 SJ151.3 SJ152.3 SJ157.3 SJ158.3 SJ159.3 SJ160.3 SJ177.2 SJ178.2 SJ179.3 SJ180.3 SJ181.2 SJ182.2 SJ183.3 SJ184.3 SJ185.2 SJ186.2 SJ187.3 SJ188.3 SJ189.2 SJ190.2 SJ191.3 SJ192.3 SJ197.3 SJ198.3 SJ199.3 SJ200.3
N$1: C1.1 C3.2 SJ9.1
N$2: C1.2 C3.1 SJ9.2
N$3: C2.1 C4.2 SJ10.1
N$4: C2.2 C4.1 SJ10.2
N$5: C5.1 C6.2 SJ11.2
N$6: C5.2 SJ11.1
N$7: C6.1 SJ11.3
N$8: C7.2 C8.1 SJ12.2
N$9: C8.2 SJ12.1
N$10: C7.1 SJ12.3
N$11: C10.2 C12.1 SJ14.2
N$12: C10.1 C12.2 SJ14.1
N$13: C9.1 C11.2 SJ13.1
N$14: C9.2 C11.1 SJ13.2
N$15: C13.1 C15.2 SJ15.2
N$16: C13.2 SJ15.1
N$17: C15.1 SJ15.3
N$18: C14.1 C16.2 SJ16.2
N$19: C14.2 SJ16.1
N$20: C16.1 SJ16.3
N$21: C17.1 SJ17.1
N$22: C18.1 SJ18.1
N$23: C37.1 C39.2 SJ49.1
N$24: C19.1 SJ19.2
N$25: C19.2 SJ19.1
N$26: C20.1 SJ20.2
N$27: C20.2 SJ20.1
N$28: C21.1 SJ33.1
N$29: C37.2 C39.1 SJ49.2
N$30: C22.1 SJ34.1
N$31: C23.1 SJ35.2
N$32: C23.2 SJ35.1
N$33: C24.2 SJ36.1
N$34: C24.1 SJ36.2
N$35: C25.1 SJ37.1
N$36: C38.1 C40.2 SJ50.1
N$37: C26.1 SJ38.1
N$38: C38.2 C40.1 SJ50.2
N$39: C27.1 C33.2 SJ39.2
N$40: C27.2 SJ39.1
N$41: C41.1 C42.2 SJ51.2
N$42: C28.1 C34.2 SJ40.2
N$43: C28.2 SJ40.1
N$44: C41.2 SJ51.1
N$45: C29.1 SJ41.1
N$46: C42.1 SJ51.3
N$47: C30.1 SJ42.1
N$48: C43.2 C44.1 SJ52.2
N$49: C31.1 C35.2 SJ43.2
N$50: C31.2 SJ43.1
N$51: C32.1 C36.2 SJ44.2
N$52: C32.2 SJ44.1
N$53: C44.2 SJ52.1
N$54: C43.1 SJ52.3
N$55: C46.2 C48.1 SJ54.2
N$56: C46.1 C48.2 SJ54.1
N$57: C45.1 C47.2 SJ53.1
N$58: C45.2 C47.1 SJ53.2
N$59: C49.1 C51.2 SJ55.2
N$60: C49.2 SJ55.1
N$61: C51.1 SJ55.3
N$62: C50.1 C52.2 SJ56.2
N$63: C50.2 SJ56.1
N$64: C52.1 SJ56.3
N$65: C53.1 SJ57.1
N$66: C54.1 SJ58.1
N$67: C55.1 SJ59.2
N$68: C55.2 SJ59.1
N$69: C56.1 SJ60.2
N$70: C56.2 SJ60.1
N$71: C57.1 SJ61.1
N$72: C58.1 SJ62.1
N$73: C59.1 SJ63.2
N$74: C59.2 SJ63.1
N$75: C60.2 SJ64.1
N$76: C60.1 SJ64.2
N$77: C61.1 SJ65.1
N$78: C62.1 SJ66.1
N$79: C63.1 C69.2 SJ67.2
N$80: C63.2 SJ67.1
N$81: C64.1 C70.2 SJ68.2
N$82: C64.2 SJ68.1
N$83: C65.1 SJ69.1
N$84: C66.1 SJ70.1
N$85: C67.1 C71.2 SJ71.2
N$86: C67.2 SJ71.1
N$87: C68.1 C72.2 SJ72.2
N$88: C68.2 SJ72.1
N$89: C73.1 C75.2 SJ89.1
N$90: C73.2 C75.1 SJ89.2
N$91: C74.1 C76.2 SJ90.1
N$92: C74.2 C76.1 SJ90.2
N$93: C77.1 C78.2 SJ91.2
N$94: C77.2 SJ91.1
N$95: C78.1 SJ91.3
N$96: C79.2 C80.1 SJ92.2
N$97: C80.2 SJ92.1
N$98: C79.1 SJ92.3
N$99: C82.2 C84.1 SJ94.2
N$100: C82.1 C84.2 SJ94.1
N$101: C81.1 C83.2 SJ93.1
N$102: C81.2 C83.1 SJ93.2
N$103: C85.1 C87.2 SJ95.2
N$104: C85.2 SJ95.1
N$105: C87.1 SJ95.3
N$106: C86.1 C88.2 SJ96.2
N$107: C86.2 SJ96.1
N$108: C88.1 SJ96.3
N$109: C89.1 SJ97.1
N$110: C90.1 SJ98.1
N$111: C91.1 SJ99.2
N$112: C91.2 SJ99.1
N$113: C92.1 SJ100.2
N$114: C92.2 SJ100.1
N$115: C93.1 SJ101.1
N$116: C94.1 SJ102.1
N$117: C95.1 SJ103.2
N$118: C95.2 SJ103.1
N$119: C96.2 SJ104.1
N$120: C96.1 SJ104.2
N$121: C97.1 SJ105.1
N$122: C98.1 SJ106.1
N$123: C99.1 C105.2 SJ107.2
N$124: C99.2 SJ107.1
N$125: C100.1 C106.2 SJ108.2
N$126: C100.2 SJ108.1
N$127: C101.1 SJ109.1
N$128: C102.1 SJ110.1
N$129: C103.1 C107.2 SJ111.2
N$130: C103.2 SJ111.1
N$131: C104.1 C108.2 SJ112.2
N$132: C104.2 SJ112.1
N$133: C109.1 C111.2 SJ129.1
N$134: C109.2 C111.1 SJ129.2
N$135: C110.1 C112.2 SJ130.1
N$136: C110.2 C112.1 SJ130.2
N$137: C113.1 C114.2 SJ131.2
N$138: C113.2 SJ131.1
N$139: C114.1 SJ131.3
N$140: C115.2 C116.1 SJ132.2
N$141: C116.2 SJ132.1
N$142: C115.1 SJ132.3
N$143: C118.2 C120.1 SJ134.2
N$144: C118.1 C120.2 SJ134.1
N$145: C117.1 C119.2 SJ133.1
N$146: C117.2 C119.1 SJ133.2
N$147: C121.1 C123.2 SJ135.2
N$148: C121.2 SJ135.1
N$149: C123.1 SJ135.3
N$150: C122.1 C124.2 SJ136.2
N$151: C122.2 SJ136.1
N$152: C124.1 SJ136.3
N$153: C125.1 SJ137.1
N$154: C126.1 SJ138.1
N$155: C127.1 SJ139.2
N$156: C127.2 SJ139.1
N$157: C128.1 SJ140.2
N$158: C128.2 SJ140.1
N$159: C129.1 SJ141.1
N$160: C130.1 SJ142.1
N$161: C131.1 SJ143.2
N$162: C131.2 SJ143.1
N$163: C132.2 SJ144.1
N$164: C132.1 SJ144.2
N$165: C133.1 SJ145.1
N$166: C134.1 SJ146.1
N$167: C135.1 C141.2 SJ147.2
N$168: C135.2 SJ147.1
N$169: C136.1 C142.2 SJ148.2
N$170: C136.2 SJ148.1
N$171: C137.1 SJ149.1
N$172: C138.1 SJ150.1
N$173: C139.1 C143.2 SJ151.2
N$174: C139.2 SJ151.1
N$175: C140.1 C144.2 SJ152.2
N$176: C140.2 SJ152.1
N$177: C145.1 C147.2 SJ169.1
N$178: C145.2 C147.1 SJ169.2
N$179: C146.1 C148.2 SJ170.1
N$180: C146.2 C148.1 SJ170.2
N$181: C149.1 C150.2 SJ171.2
N$182: C149.2 SJ171.1
N$183: C150.1 SJ171.3
N$184: C151.2 C152.1 SJ172.2
N$185: C152.2 SJ172.1
N$186: C151.1 SJ172.3
N$187: C154.2 C156.1 SJ174.2
N$188: C154.1 C156.2 SJ174.1
N$189: C153.1 C155.2 SJ173.1
N$190: C153.2 C155.1 SJ173.2
N$191: C157.1 C159.2 SJ175.2
N$192: C157.2 SJ175.1
N$193: C159.1 SJ175.3
N$194: C158.1 C160.2 SJ176.2
N$195: C158.2 SJ176.1
N$196: C160.1 SJ176.3
N$197: C161.1 SJ177.1
N$198: C162.1 SJ178.1
N$199: C163.1 SJ179.2
N$200: C163.2 SJ179.1
N$201: C164.1 SJ180.2
N$202: C164.2 SJ180.1
N$203: C165.1 SJ181.1
N$204: C166.1 SJ182.1
N$205: C167.1 SJ183.2
N$206: C167.2 SJ183.1
N$207: C168.2 SJ184.1
N$208: C168.1 SJ184.2
N$209: C169.1 SJ185.1
N$210: C170.1 SJ186.1
N$211: C171.1 C177.2 SJ187.2
N$212: C171.2 SJ187.1
N$213: C172.1 C178.2 SJ188.2
N$214: C172.2 SJ188.1
N$215: C173.1 SJ189.1
N$216: C174.1 SJ190.1
N$217: C175.1 C179.2 SJ191.2
N$218: C175.2 SJ191.1
N$219: C176.1 C180.2 SJ192.2
N$220: C176.2 SJ192.1
Unconnected: SJ1.1 SJ1.2 SJ2.1 SJ2.2 SJ3.1 SJ3.2 SJ3.3 SJ4.1 SJ4.2 SJ4.3 SJ5.1 SJ5.2 SJ6.1 SJ6.2 SJ7.1 SJ7.2 SJ7.3 SJ8.1 SJ8.2 SJ8.3 SJ21.1 SJ21.2 SJ21.3 SJ22.1 SJ22.2 SJ22.3 SJ23.1 SJ23.2 SJ23.3 SJ24.1 SJ24.2 SJ24.3 SJ25.1 SJ25.2 SJ26.1 SJ26.2 SJ27.1 SJ27.2 SJ28.1 SJ28.2 SJ29.1 SJ29.2 SJ30.1 SJ30.2 SJ31.1 SJ31.2 SJ31.3 SJ32.1 SJ32.2 SJ32.3 SJ45.1 SJ45.2 SJ46.1 SJ46.2 SJ47.1 SJ47.2 SJ47.3 SJ48.1 SJ48.2 SJ48.3 SJ73.1 SJ73.2 SJ73.3 SJ74.1 SJ74.2 SJ74.3 SJ75.1 SJ75.2 SJ75.3 SJ76.1 SJ76.2 SJ76.3 SJ77.1 SJ77.2 SJ78.1 SJ78.2 SJ79.1 SJ79.2 SJ80.1 SJ80.2 SJ81.1 SJ81.2 SJ82.1 SJ82.2 SJ83.1 SJ83.2 SJ83.3 SJ84.1 SJ84.2 SJ84.3 SJ85.1 SJ85.2 SJ86.1 SJ86.2 SJ87.1 SJ87.2 SJ87.3 SJ88.1 SJ88.2 SJ88.3 SJ113.1 SJ113.2 SJ113.3 SJ114.1 SJ114.2 SJ114.3 SJ115.1 SJ115.2 SJ115.3 SJ116.1 SJ116.2 SJ116.3 SJ117.1 SJ117.2 SJ118.1 SJ118.2 SJ119.1 SJ119.2 SJ120.1 SJ120.2 SJ121.1 SJ121.2 SJ122.1 SJ122.2 SJ123.1 SJ123.2 SJ123.3 SJ124.1 SJ124.2 SJ124.3 SJ125.1 SJ125.2 SJ126.1 SJ126.2 SJ127.1 SJ127.2 SJ127.3 SJ128.1 SJ128.2 SJ128.3 SJ153.1 SJ153.2 SJ153.3 SJ154.1 SJ154.2 SJ154.3 SJ155.1 SJ155.2 SJ155.3 SJ156.1 SJ156.2 SJ156.3 SJ157.1 SJ157.2 SJ158.1 SJ158.2 SJ159.1 SJ159.2 SJ160.1 SJ160.2 SJ161.1 SJ161.2 SJ162.1 SJ162.2 SJ163.1 SJ163.2 SJ163.3 SJ164.1 SJ164.2 SJ164.3 SJ165.1 SJ165.2 SJ166.1 SJ166.2 SJ167.1 SJ167.2 SJ167.3 SJ168.1 SJ168.2 SJ168.3 SJ193.1 SJ193.2 SJ193.3 SJ194.1 SJ194.2 SJ194.3 SJ195.1 SJ195.2 SJ195.3 SJ196.1 SJ196.2 SJ196.3 SJ197.1 SJ197.2 SJ198.1 SJ198.2 SJ199.1 SJ199.2 SJ200.1 SJ200.2

## Notes on the sheet
- 80% | Control | Control | Control | Control | Control | Control | Control
- 60% | Control | Control | Control | Control | Control | Control | Control
- 40% | Control | Control | Control | Control | Control | Control | Control
- 20% | Control | Control | Control | Control | Control | Control | Control
- Control | Control | Control | Control | Control | Control | Control | Control

## Library data of the parts
C1-C180 = SparkFun-Capacitors:0.1UF-25V-5%(0603): CAP-08604; PROD_ID: CAP-08604
SJ1 SJ2 SJ5 SJ6 SJ9 SJ10 SJ13 SJ14 SJ17 SJ18 SJ29 SJ30 SJ33 SJ34 SJ37 SJ38 SJ41 SJ42 SJ45 SJ46 SJ49 SJ50 SJ53 SJ54 SJ57 SJ58 SJ61 SJ62 SJ65 SJ66 SJ69 SJ70 SJ81 SJ82 SJ85 SJ86 SJ89 SJ90 SJ93 SJ94 SJ97 SJ98 SJ101 SJ102 SJ105 SJ106 SJ109 SJ110 SJ121 SJ122 SJ125 SJ126 SJ129 SJ130 SJ133 SJ134 SJ137 SJ138 SJ141 SJ142 SJ145 SJ146 SJ149 SJ150 SJ161 SJ162 SJ165 SJ166 SJ169 SJ170 SJ173 SJ174 SJ177 SJ178 SJ181 SJ182 SJ185 SJ186 SJ189 SJ190 = TestAperatures:JUMPER-PAD-2-NO
SJ3 SJ4 SJ7 SJ8 SJ11 SJ12 SJ15 SJ16 SJ19-SJ28 SJ31 SJ32 SJ35 SJ36 SJ39 SJ40 SJ43 SJ44 SJ47 SJ48 SJ51 SJ52 SJ55 SJ56 SJ59 SJ60 SJ63 SJ64 SJ67 SJ68 SJ71-SJ80 SJ83 SJ84 SJ87 SJ88 SJ91 SJ92 SJ95 SJ96 SJ99 SJ100 SJ103 SJ104 SJ107 SJ108 SJ111-SJ120 SJ123 SJ124 SJ127 SJ128 SJ131 SJ132 SJ135 SJ136 SJ139 SJ140 SJ143 SJ144 SJ147 SJ148 SJ151-SJ160 SJ163 SJ164 SJ167 SJ168 SJ171 SJ172 SJ175 SJ176 SJ179 SJ180 SJ183 SJ184 SJ187 SJ188 SJ191-SJ200 = TestAperatures:JUMPER-PAD-3-NO